# Altium project ExtruderBreakout.PrjPcb
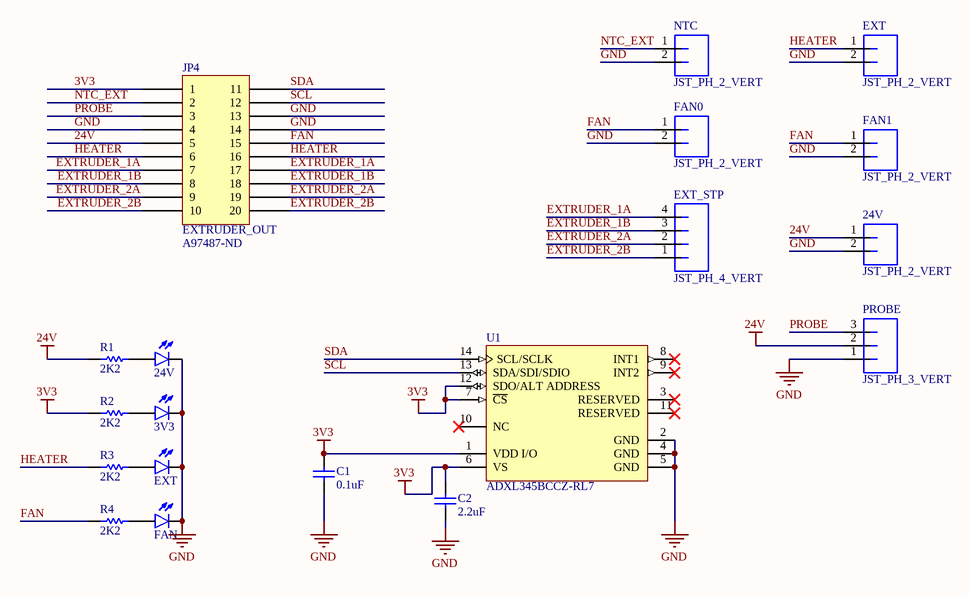
[diagram p0: ExtruderBreakout.SchDoc]
1 sheet, 19 parts. Net scope: global (net labels, ports and power ports of the same name join across sheets).
Board file: ExtruderBreakout.PcbDoc

## Sheet ExtruderBreakout.SchDoc
size A

### Parts
(Parts that share a designator on the sheet are numbered #1, #2 ... from top to bottom, then left to right.)
3V3  LED_0603_BLUE_5mA  [LED0603]  (value not drawn)
24V#1  JST_PH_2_VERT  [JST-PH-2-PTH-VERT]
24V#2  LED_0603_GREEN_5mA  [LED0603]  (value not drawn)
C1  value 0.1uF  [C0402[1005X55]]  (hidden comment: 0.1uF 6.3V 0402)
C2  value 2.2uF  [C0402[1005X55]]  (hidden comment: 2.2uF 6.3V 0402)
EXT#1  JST_PH_2_VERT  [JST-PH-2-PTH-VERT]
EXT#2  LED_0603_ORANGE_5mA  [LED0603]  (value not drawn)
EXT_STP  JST_PH_4_VERT  [JST-PH-4-PTH-VERT]
FAN  LED_0603_ORANGE_5mA  [LED0603]  (value not drawn)
FAN0  JST_PH_2_VERT  [JST-PH-2-PTH-VERT]
FAN1  JST_PH_2_VERT  [JST-PH-2-PTH-VERT]
JP4  EXTRUDER_OUT  Supplier Part Number 1: A97487-ND  [IDC20]
NTC  JST_PH_2_VERT  [JST-PH-2-PTH-VERT]
PROBE  JST_PH_3_VERT  [JST-PH-3-PTH-VERT]
R1  value 2K2  [R0402[1005]]  (hidden comment: 2K2 1% 0402)
R2  value 2K2  [R0402[1005]]  (hidden comment: 2K2 1% 0402)
R3  value 2K2  [R0402[1005]]  (hidden comment: 2K2 1% 0402)
R4  value 2K2  [R0402[1005]]  (hidden comment: 2K2 1% 0402)
U1  ADXL345BCCZ-RL7  [ADI-CC-14-1_V]

### Nets
3V3: C1.2 C2.2 JP4.1 R2.1 U1.1(VDD_I/O) U1.6(VS) U1.7(~{CS}) U1.12(SDO/ALT_ADDRESS)
24V: 24V#1.1 JP4.5 PROBE.2 R1.1
GND: 3V3.C 24V#1.2 24V#2.C C1.1 C2.1 EXT#1.2 EXT#2.C FAN.C FAN0.2 FAN1.2 JP4.4 JP4.13 JP4.14 NTC.2 PROBE.1 U1.2(GND) U1.4(GND) U1.5(GND)
EXTRUDER_1A: EXT_STP.4 JP4.7 JP4.17
EXTRUDER_1B: EXT_STP.3 JP4.8 JP4.18
EXTRUDER_2A: EXT_STP.2 JP4.9 JP4.19
EXTRUDER_2B: EXT_STP.1 JP4.10 JP4.20
FAN: FAN0.1 FAN1.1 JP4.15 R4.1
HEATER: EXT#1.1 JP4.6 JP4.16 R3.1
NTC_EXT: JP4.2 NTC.1
PROBE: JP4.3 PROBE.3
SCL: JP4.12 U1.13(SDA/SDI/SDIO)
SDA: JP4.11 U1.14(SCL/SCLK)
Net3V3_A: 3V3.A R2.2
Net24V#2_A: 24V#2.A R1.2
NetEXT#2_A: EXT#2.A R3.2
NetFAN_A: FAN.A R4.2

Not connected (* = marked no-connect by the designer): U1 3(RESERVED)* 8(INT1)* 9(INT2)* 10(NC)* 11(RESERVED)*

### Library data of the parts
3V3 = LED_0603_BLUE_5mA: PartNumber: LTST-C193TBKT-5A; Manufacturer: Lite-On Inc.; PackageReference: 0603; PackageDescription: 0603 (1608 Metric); Mounting Technology: Surface Mount
24V#1 EXT#1 FAN0 FAN1 NTC = JST_PH_2_VERT: Manufacturer: JST Sales America, Inc.; PartNumber: B2B-PH-K-S(LF)(SN); Mounting Technology: Through Hole; PackageReference: JST-PH
24V#2 = LED_0603_GREEN_5mA: PartNumber: LTST-C193TGKT-5A; Manufacturer: Lite-On Inc.; PackageReference: 0603; PackageDescription: 0603 (1608 Metric); Mounting Technology: Surface Mount
C1 = CAP_0.1uF_6.3V_0402_10%: 0.1uF 6.3V 10% 0402 (1005 Metric); PartNumber: GRM155R70J104KA01D; Manufacturer: Murata; Mounting Technology: Surface Mount; PackageReference: 0402; PackageDescription: 0402 (1005 Metric); Voltage: 6.3V; Tolerance: 10%
C2 = CAP_2.2uF_6.3V_0402_20%: 2.2uF 6.3V 20% 0402 (1005 Metric); PartNumber: GRM155R60J225ME15D; Manufacturer: Murata; Mounting Technology: Surface Mount; PackageReference: 0402; PackageDescription: 0402 (1005 Metric); Voltage: 6.3V; Tolerance: 20%
EXT#2 FAN = LED_0603_ORANGE_5mA: PartNumber: LTST-C193KFKT-5A; Manufacturer: Lite-On Inc.; PackageReference: 0603; PackageDescription: 0603 (1608 Metric); Mounting Technology: Surface Mount
EXT_STP = JST_PH_4_VERT: PartNumber: B4B-PH-K-S(LF)(SN); Manufacturer: JST Sales America Inc.; PackageReference: JST-PH; Mounting Technology: Through Hole
JP4 = IDC20: Supplier 1: Digi-Key
R1-R4 = RES_2K2_0402_1%: 2K2 0.063W 1% 0402 (1005 Metric); Manufacturer: KOA Speer; PartNumber: RK73H1ETTP2201F; Tolerance: 1%; Power: 0.063W; Mounting Technology: Surface Mount; PackageReference: 0402; PackageDescription: 0402 (1005 Metric); ComponentLink1Description: Datasheet; ComponentLink1URL: http://www.koaspeer.com/catimages/Products/RK73H/RK73H.pdf
U1 = CMP-0885-00033-1: 3-Axis, +/-2 g / +/-4 g / +/-8 g / +/-16 g Digital Accelerometer with Digital Output, 1.6 KHz BW, Industrial, 14-pin LGA, Reel; Manufacturer: Analog Devices; Supply Current: 140 uA; Voltage Supply (V): 2.0 to 3.6; -3dB Bandwidth: 1.6 KHz; Sensitivity: 256/128/64/32 LSB/g; # of Axes: 3; Output Type: Digital; PackageDescription: 14-Pin Land Grid Array, 3 x 5 mm Body, 0.8 mm Pitch; ComponentLink1URL: http://www.analog.com/en/index.html; ComponentLink2Description: Datasheet; PartNumber: ADXL345BCCZ-RL7; ComponentLink3Description: Package Specification; ComponentLink4URL: http://www.analog.com/en/mems-sensors/mems-inertial-sensors/adxl345/products/product.html; PackageVersion: 03-16-2010-A, 03/2010; ComponentLink1Description: Manufacturer URL; ComponentLink2URL: http://www.analog.com/static/imported-files/data_sheets/ADXL345.pdf; DatasheetVersion: Rev. D; PackageReference: CC-14-1; Packing: Reel; Mounting Technology: Surface Mount; ComponentLink4Description: Product URL; ComponentLink3URL: http://www.analog.com/static/imported-files/data_sheets/ADXL343.pdf